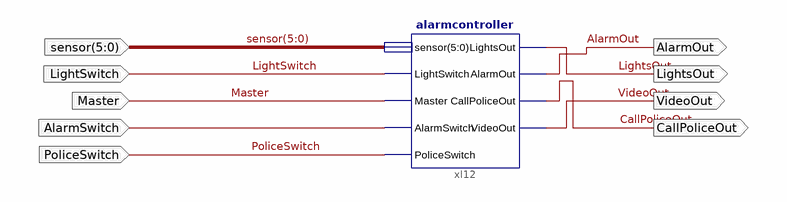
[diagram p0: schematic sheet 1]
// Xilinx ISE schematic top.sch (spartan3) as structural Verilog: 1 symbols, 9 ports
module top (
  input  [5:0] sensor,
  input  PoliceSwitch,
  input  LightSwitch,
  input  Master,
  input  AlarmSwitch,
  output CallPoliceOut,
  output VideoOut,
  output LightsOut,
  output AlarmOut
);

  alarmcontroller xl12 (
    .AlarmOut(AlarmOut), .AlarmSwitch(AlarmSwitch), .CallPoliceOut(CallPoliceOut), .LightsOut(LightsOut),
    .LightSwitch(LightSwitch), .Master(Master), .PoliceSwitch(PoliceSwitch), .sensor(sensor),
    .VideoOut(VideoOut));

  // Notes on the sheet:
  //   LOC on signal sensor(5:0) = R12,R1,T13,N15,H13,G13
  //   LOC on signal CallPoliceOut = H3
  //   LOC on signal VideoOut = H1
  //   LOC on signal LightsOut = J1
  //   LOC on signal AlarmOut = J2
  //   LOC on signal PoliceSwitch = J4
  //   LOC on signal LightSwitch = K2
  //   LOC on signal Master = K3
endmodule
